# Altium schematic sheet ValveControl.SchDoc
size A
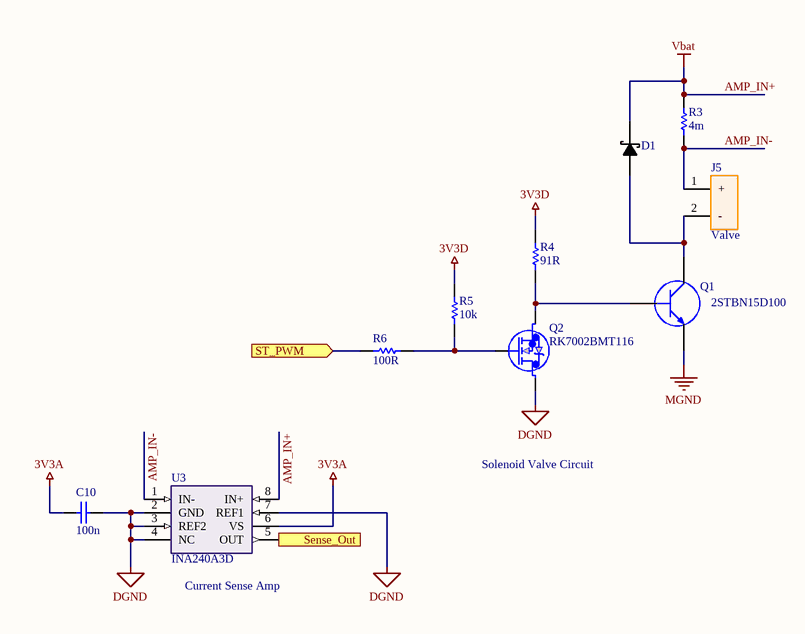
[diagram p0: ValveControl.SchDoc]

## Parts
C10  value 100n  [C0603_med_density]  (hidden comment: CapCer)
D1  1655-1921-1-ND  [DO-201AD]  (value not drawn)
J5  Valve  [MOLEX_436500200 - duplicate]
Q1  2STBN15D100  [D2PAK]
Q2  RK7002BMT116  [TRANS_RK7002BMHZG_ROM]
R3  value 4m  [R1210_med_density]  (hidden comment: ResChip)
R4  value 91R  [R0603_med_density]  (hidden comment: ResChip)
R5  value 10k  [R0603_med_density]  (hidden comment: ResChip)
R6  value 100R  [R0603_med_density]  (hidden comment: ResChip)
U3  INA240A3D  [INA240A3D]

## Ports
Sense_Out (out), ST_PWM (in)

## Nets
3V3A: C10.1 U3.6(VS)
3V3D: R4.1 R5.1
AMP_IN+: D1.2 R3.2 U3.8(IN+)  [also labelled Vbat]
DGND: C10.2 Q2.1 U3.2(GND) U3.3(REF2) U3.4(NC) U3.7(REF1)
MGND: Q1.3(B)
AMP_IN-: J5.1(+) R3.1 U3.1(IN-)
Sense_Out: U3.5(OUT) ; port Sense_Out
ST_PWM: R6.2 ; port ST_PWM
NetD1_1: D1.1 J5.2(-) Q1.1(B)
NetQ1_2: Q1.2(B) Q2.3 R4.2
NetQ2_2: Q2.2 R5.2 R6.1

## Notes on the sheet
- Solenoid Valve Circuit
- (near U3) Current Sense Amp

## Library data of the parts
C10 = CapCer: SMD Ceramic Capacitor; Rating: 6.3V; Tolerance: *; EIA RS-198 Code: *; Package: *
D1 = DiodeSchottky: Schottky Diode; PartNumber: 1655-1921-1-ND; Package: *
J5 = General Molex
Q1 = BJT: 2STBN15D100 BJT; DC Gain: 750; Part Number: 2STBN15D100; Supplier 1: Digi-Key; Supplier Part Number 1: 497-10113-1-ND
Q2 = RK7002BMT116: n-channel MOSEFT; Vendor: ROHM Semiconductor; Built_By: EMA_Matt; SourceLibrary: Rohm_2019-09-23; Type: DEV; Manufacturer_Part_Number: RK7002BMT116; Copyright: Copyright (C) 2018 Accelerated Designs. All rights reserved; RefDes: RefDes
R3 = ResChip: SMD Chip resistor; Tolerance: 1%; Rating: 0.5W; Package: *
R4 = ResChip: SMD Chip resistor; Tolerance: 1%; Rating: 0.25 W; Package: *
R5 R6 = ResChip: SMD Chip resistor; Tolerance: *; Rating: *; Package: *
U3 = INA240A3D: SchLib for TI op amp for current sensing.; Supplier 1: Digi-Key; Supplier Part Number 1: 296-48839-ND